# EAGLE design GSM_Based_Irrigation (EAGLE 6.3)
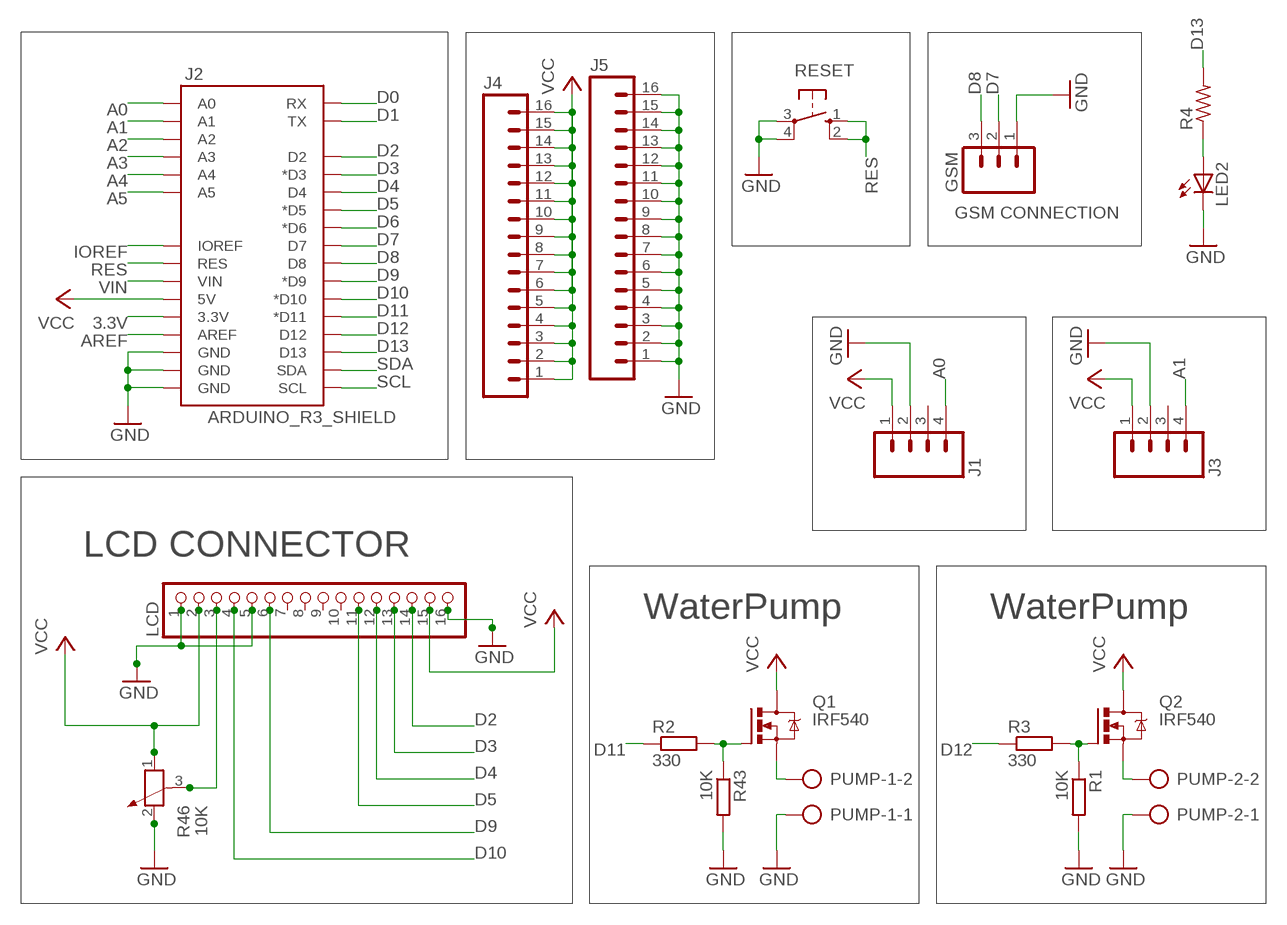
[diagram p0: schematic, sheet 1]

## Parts
GSM  M03LONGPADS  [1X03_LONGPADS]
J1  M04LONGPADS  [1X04_LONGPADS]
J2  ARDUINO_R3_SHIELD  [UNO_R3_SHIELD]
J3  M04LONGPADS  [1X04_LONGPADS]
J4  M16LONGPADS  [1X16_LONGPADS]
J5  M16LONGPADS  [1X16_LONGPADS]
LCD  PINHD-1X16  [1X16]
LED2  LED5MM  [LED5MM]
PUMP-1  AK300/2  [AK300/2]
PUMP-2  AK300/2  [AK300/2]
Q1  IRF540  [TO220BV]
Q2  IRF540  [TO220BV]
R1  10K  R-EU_0207/7  [0207/7@1]
R2  330  R-EU_0207/7  [0207/7@1]
R3  330  R-EU_0207/7  [0207/7@1]
R4  R-US_0207/10  [0207/10]
R43  10K  R-EU_0207/7  [0207/7@1]
R46  10K  POTENTIOMETER_PT-10  [PT-10]
RESET  10-XX  [B3F-10XX]

## Nets
3.3V: J2.3.3V
A0: J1.4 J2.A0
A1: J2.A1 J3.4
A2: J2.A2
A3: J2.A3
A4: J2.A4
A5: J2.A5
AREF: J2.AREF
D0: J2.RX
D1: J2.TX
D2: J2.D2 LCD.14
D3: J2.D3(*D3) LCD.13
D4: J2.D4 LCD.12
D5: J2.D5(*D5) LCD.11
D6: J2.D6(*D6)
D7: GSM.2 J2.D7
D8: GSM.3 J2.D8
D9: J2.D9(*D9) LCD.6
D10: J2.D10(*D10) LCD.4
D11: J2.D11(*D11) R2.1
D12: J2.D12 R3.1
D13: J2.D13 R4.2
GND: GSM.1 J1.2 J2.GND@0(GND) J2.GND@1(GND) J2.GND@2(GND) J3.2 J5.1 J5.2 J5.3 J5.4 J5.5 J5.6 J5.7 J5.8 J5.9 J5.10 J5.11 J5.12 J5.13 J5.14 J5.15 J5.16 LCD.1 LCD.5 LCD.16 LED2.K(C) PUMP-1.1 PUMP-2.1 R1.2 R43.2 R46.2 RESET.3(P) RESET.4(P1)
IOREF: J2.IOREF
N$1: PUMP-1.2 Q1.S
N$2: PUMP-2.2 Q2.S
N$3: Q1.G R2.2 R43.1
N$4: LED2.A R4.1
N$5: Q2.G R1.1 R3.2
N$68: LCD.3 R46.3
RES: J2.RES RESET.1(S) RESET.2(S1)
SCL: J2.SCL
SDA: J2.SDA
VCC: J1.1 J2.5V J3.1 J4.1 J4.2 J4.3 J4.4 J4.5 J4.6 J4.7 J4.8 J4.9 J4.10 J4.11 J4.12 J4.13 J4.14 J4.15 J4.16 LCD.2 LCD.15 Q1.D Q2.D R46.1
VIN: J2.VIN
Unconnected: J1.3 J3.3 LCD.7 LCD.8 LCD.9 LCD.10

## Notes on the sheet
- GSM CONNECTION
- LCD CONNECTOR
- WaterPump | WaterPump

## Library data of the parts
GSM = SparkFun-Connectors:M03: Header 3 Standard 3-pin 0.1" header. Use with straight break away headers (SKU : PRT-00116), right angle break away headers (PRT-00553), swiss pins (PRT-00743), machine pins (PRT-00117), and female headers (PRT-00115). Molex polarized connector foot print use with SKU : PRT-08232 with associated crimp pins and housings.
J1 J3 = SparkFun-Connectors:M04: Header 4 Standard 4-pin 0.1" header. Use with straight break away headers (SKU : PRT-00116), right angle break away headers (PRT-00553), swiss pins (PRT-00743), machine pins (PRT-00117), and female headers (PRT-00115). Molex polarized connector foot print use with SKU : PRT-08231 with associated crimp pins and housings. 1MM SMD Version SKU: PRT-10208; PROD_ID: CONN-09696
J2 = SparkFun-Boards:ARDUINO_R3_SHIELD: Shield form compatible with the Arduino Uno R3.
J4 J5 = SparkFun-Connectors:M16: 1x16 .1" header
LCD = pinhead:PINHD-1X16: PIN HEADER
LED2 = led:LED: LED OSRAM: - CHIPLED LG R971, LG N971, LY N971, LG Q971, LY Q971, LO R971, LY R971 LH N974, LH R974 LS Q976, LO Q976, LY Q976 LO Q996 - Hyper CHIPLED LW Q18S LB Q993, LB Q99A, LB R99A - SideLED LS A670, LO A670, LY A670, LG A670, LP A670 LB A673, LV A673, LT A673, LW A673 LH A674 LY A675 LS A676, LA A676, LO A676, LY A676, LW A676 LS A679, LY A679, LG A679 - Hyper Micro SIDELED® LS Y876, LA Y876, LO Y876, LY Y876 LT Y87S - SmartLED LW L88C, LW L88S LB L89C, LB L89S, LG L890 LS L89K, LO L89K, LY L89K LS L896, LA L896, LO L896, LY L896 - TOPLED LS T670, LO T670, LY T670, LG T670, LP T670 LSG T670, LSP T670, LSY T670, LOP T670, LYG T670 LG T671, LOG T671, LSG T671 LB T673, LV T673, LT T673, LW T673 LH T674 LS T676, LA T676, LO T676, LY T676, LB T676, LH T676, LSB T676, LW T676 LB T67C, LV T67C, LT T67C, LS T67K, LO T67K, LY T67K, LW E67C LS E67B, LA E67B, LO E67B, LY E67B, LB E67C, LV E67C, LT E67C LW T67C LS T679, LY T679, LG T679 LS T770, LO T770, LY T770, LG T770, LP T770 LB T773, LV T773, LT T773, LW T773 LH T774 LS E675, LA E675, LY E675, LS T675 LS T776, LA T776, LO T776, LY T776, LB T776 LHGB T686 LT T68C, LB T68C - Hyper Mini TOPLED® LB M676 - Mini TOPLED Santana® LG M470 LS M47K, LO M47K, LY M47K Source: http://www.osram.convergy.de LUXEON: - LUMILED® LXK2-PW12-R00, LXK2-PW12-S00, LXK2-PW14-U00, LXK2-PW14-V00 LXK2-PM12-R00, LXK2-PM12-S00, LXK2-PM14-U00 LXK2-PE12-Q00, LXK2-PE12-R00, LXK2-PE12-S00, LXK2-PE14-T00, LXK2-PE14-U00 LXK2-PB12-K00, LXK2-PB12-L00, LXK2-PB12-M00, LXK2-PB14-N00, LXK2-PB14-P00, LXK2-PB14-Q00 LXK2-PR12-L00, LXK2-PR12-M00, LXK2-PR14-Q00, LXK2-PR14-R00 LXK2-PD12-Q00, LXK2-PD12-R00, LXK2-PD12-S00 LXK2-PH12-R00, LXK2-PH12-S00 LXK2-PL12-P00, LXK2-PL12-Q00, LXK2-PL12-R00 Source: www.luxeon.com KINGBRIGHT: KA-3528ASYC Source: www.kingbright.com
PUMP-1 PUMP-2 = con-ptr500:AK300/2: CONNECTOR; OC_FARNELL: unknown; OC_NEWARK: unknown
Q1 Q2 = transistor-power:IRF540: HEXFET Power MOSFET
R1-R3 R43 = rcl:R-EU_: RESISTOR, European symbol
R4 = rcl:R-US_: RESISTOR, American symbol
R46 = rcl:POTENTIOMETER_: Potentiometer
RESET = switch-omron:10-XX: OMRON SWITCH; MPN: B3F-1000; OC_FARNELL: 176432; OC_NEWARK: 36M3542

## Board
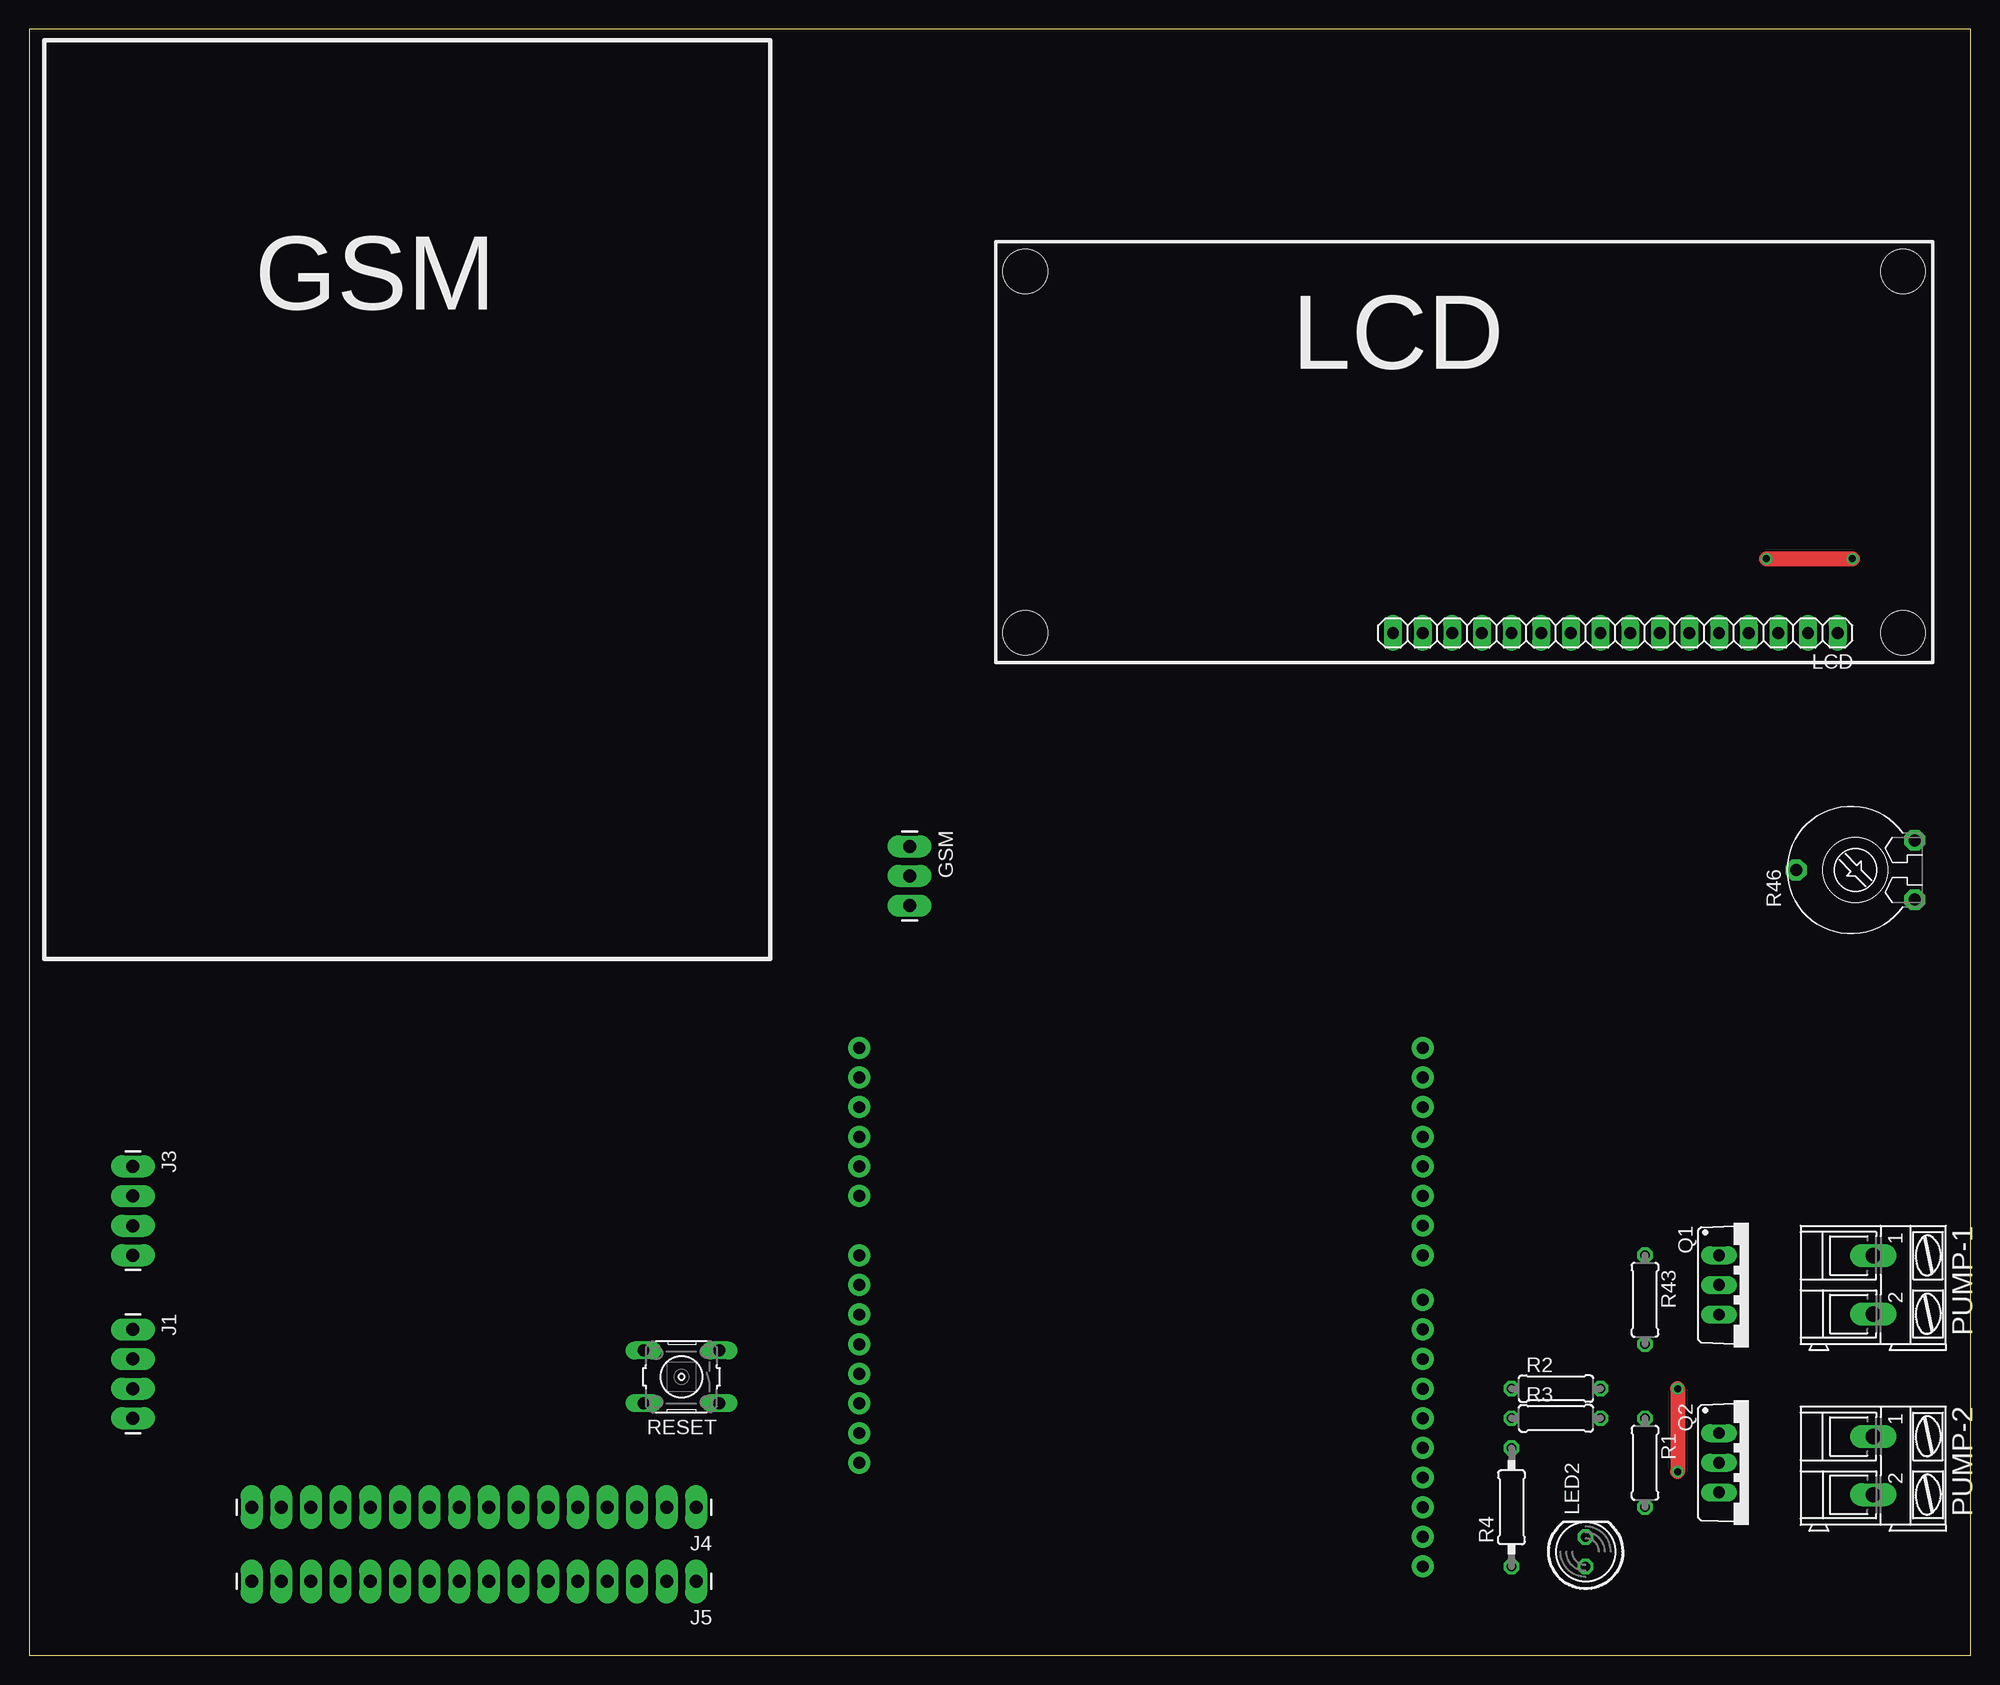
[diagram p1: board, top side]
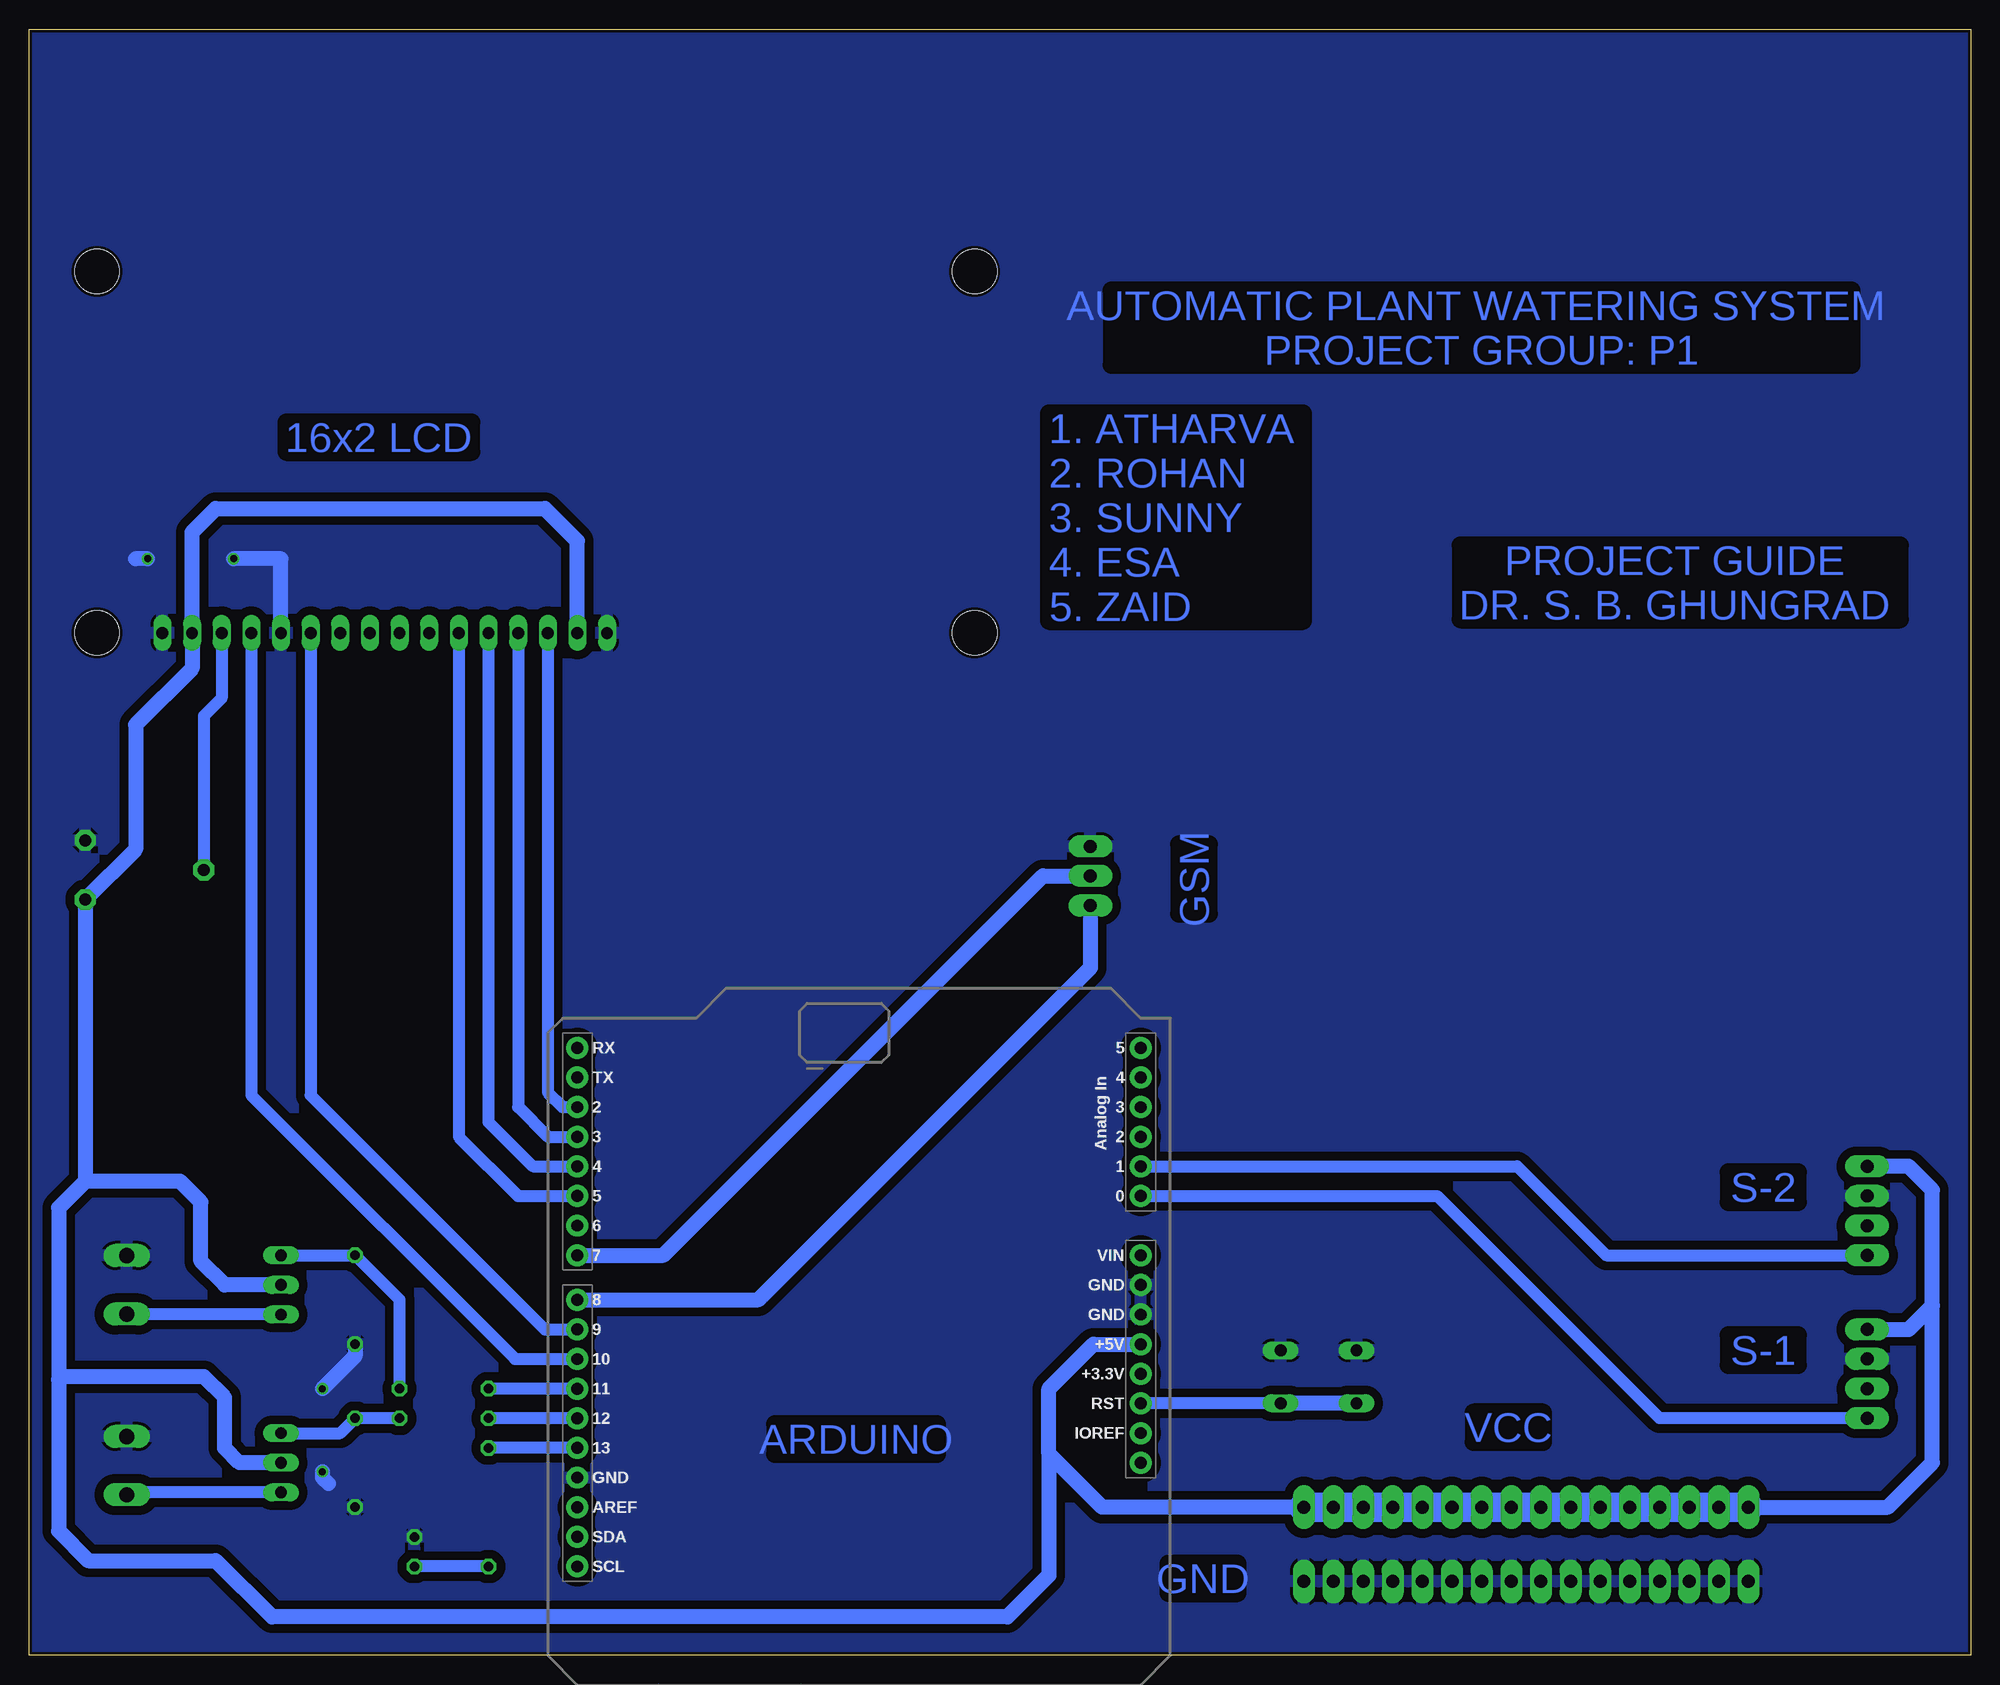
[diagram p2: board, bottom side, seen from below]

Size 166.35 x 139.37 mm. Coordinates in mm from the lower left corner, seen from the top.
Outline: 0,0 166.35,0 166.35,139.37 0,139.37 0,0
Copper layers (1*16): Top 0.035mm / dielectric 1.5mm / Bottom 0.035mm
Design rules "default *": minimum track width 10mil, minimum drill 24mil, track to track 30mil, track to pad 30mil, pad to pad 30mil, via to via 30mil, smd to smd 30mil, copper to edge 10mil, drill to drill 8mil, minimum pad ring 10mil, minimum via ring 8mil, stop-mask expansion 4mil, vias tented up to drill 0mil, thermal gap 10mil
Holes 3.81 mm at 85.34,118.62 85.34,87.63 160.53,87.63 160.53,118.62

### Footprints (pad centres in the part's own frame; a part is rotated, then mirrored left to right if it is on the bottom)
1X03_LONGPADS = drill 1.118 pad 1.88 long: 1 0,0; 2 2.54,0; 3 5.08,0
1X04_LONGPADS = drill 1.118 pad 1.88 long: 1 0,0; 2 2.54,0; 3 5.08,0; 4 7.62,0
UNO_R3_SHIELD = drill 1.016 pad 1.88: 3.3V 50.8,26.67; 5V 50.8,29.21; A0 50.8,41.91; A1 50.8,44.45; A2 50.8,46.99; A3 50.8,49.53; A4 50.8,52.07; A5 50.8,54.61; AREF 2.54,15.24; D2 2.54,49.53; D3 2.54,46.99; D4 2.54,44.45; D5 2.54,41.91; D6 2.54,39.37; D7 2.54,36.83; D8 2.54,33.02; D9 2.54,30.48; D10 2.54,27.94; D11 2.54,25.4; D12 2.54,22.86; D13 2.54,20.32; GND@0 50.8,31.75; GND@1 50.8,34.29; GND@2 2.54,17.78; IOREF 50.8,21.59; NC 50.8,19.05; RES 50.8,24.13; RX 2.54,54.61; SCL 2.54,10.16; SDA 2.54,12.7; TX 2.54,52.07; VIN 50.8,36.83
1X16_LONGPADS = drill 1.118 pad 1.88 long: 1 0,0; 2 2.54,0; 3 5.08,0; 4 7.62,0; 5 10.16,0; 6 12.7,0; 7 15.24,0; 8 17.78,0; 9 20.32,0; 10 22.86,0; 11 25.4,0; 12 27.94,0; 13 30.48,0; 14 33.02,0; 15 35.56,0; 16 38.1,0
1X16 = drill 1.016 long: 1 -19.05,0; 2 -16.51,0; 3 -13.97,0; 4 -11.43,0; 5 -8.89,0; 6 -6.35,0; 7 -3.81,0; 8 -1.27,0; 9 1.27,0; 10 3.81,0; 11 6.35,0; 12 8.89,0; 13 11.43,0; 14 13.97,0; 15 16.51,0; 16 19.05,0
LED5MM = drill 0.813 octagon: A -1.27,0; K 1.27,0
AK300/2 = drill 1.321 long: 1 -2.515,0; 2 2.489,0
TO220BV = drill 1.016 long: D 0,-2.54; G -2.54,-2.54; S 2.54,-2.54
0207/7@1 = drill 0.813 octagon: 1 -3.81,0; 2 3.81,0
0207/10 = drill 0.813 octagon: 1 -5.08,0; 2 5.08,0
PT-10 = drill 1.016 pad 1.778 octagon: 1 -2.54,-5.08; 2 2.54,-5.08; 3 0,5.08
B3F-10XX = drill 1.016 long: 1 -3.251,2.261; 2 3.251,2.261; 3 -3.251,-2.261; 4 3.251,-2.261

### Placement (x,y rotation side)
GSM  75.44,69.34 270 top
J1  8.89,27.94 270 top
J2  121.92,-2.54 0 bottom
J3  8.89,41.91 270 top
J4  57.15,12.7 180 top
J5  57.15,6.35 180 top
LCD  135.89,87.63 180 top
LED2  133.35,8.89 90 top
PUMP-1  157.99,31.75 270 top
PUMP-2  157.99,16.26 270 top
Q1  147.32,31.75 270 top
Q2  147.32,16.51 270 top
R1  138.43,16.51 270 top
R2  130.81,22.86 0 top
R3  130.81,20.32 0 top
R4  127,12.7 90 top
R43  138.43,30.48 270 top
R46  156.46,67.31 90 top
RESET  55.88,23.88 180 top

### Tracks (layer width: path | path; a pad name or v marks a point on that pad's centre or on a via)
A0
  Bottom 1.016: J2.A0 45.72,39.37 26.67,20.32 J1.4
A1
  Bottom 1.016: J2.A1 38.86,41.91 31.24,34.29 J3.4
D2
  Bottom 1.016: LCD.14 121.92,48.26 120.65,46.99 J2.D2
D3
  Bottom 1.016: LCD.13 124.46,46.99 121.92,44.45 J2.D3
D4
  Bottom 1.016: LCD.12 127,45.72 123.19,41.91 J2.D4
D5
  Bottom 1.016: LCD.11 129.54,44.45 124.46,39.37 J2.D5
D7
  Bottom 1.27: J2.D7 112.01,34.29 79.5,66.8 GSM.2
D8
  Bottom 1.27: GSM.3 75.44,58.93 103.38,30.99 103.63,30.73 103.89,30.48 J2.D8
D9
  Bottom 1.016: LCD.6 142.24,48.01 122.17,27.94 J2.D9
D10
  Bottom 1.016: LCD.4 147.32,48.01 124.71,25.4 J2.D10
D11
  Bottom 1.016: J2.D11 R2.1
D12
  Bottom 1.016: J2.D12 R3.1
D13
  Bottom 1.016: J2.D13 R4.2
GND  (via drill 0.6)
  Top 1.27: v148.84,93.98 v156.21,93.98 | v141.22,22.86 v141.22,15.75
  Bottom 1.27: LCD.5 144.78,93.98 v148.84,93.98 | v156.21,93.98 157.23,93.98 | R43.2 138.43,25.65 v141.22,22.86 | v141.22,15.75 141.22,15.24 140.72,14.73
  pour Bottom: -1.27,140.97 167.64,140.97 167.64,-1.27 -1.27,-1.27
N$1
  Bottom 1.016: Q1.S 157.94,29.21 PUMP-1.2
N$2
  Bottom 1.016: Q2.S 157.94,13.97 PUMP-2.2
N$3
  Bottom 1.016: R2.2 134.62,30.48 R43.1 Q1.G
N$4
  Bottom 1.016: R4.1 LED2.A
N$5
  Bottom 1.016: R3.2 R1.1 139.7,19.05 Q2.G
N$68
  Bottom 1.016: LCD.3 149.86,82.04 151.38,80.52 R46.3
RES
  Bottom 1.016: RESET.1 71.09,21.61 J2.RES
  Bottom 1.27: RESET.2 RESET.1
VCC
  Bottom 1.27: Q1.D 149.61,31.75 151.64,33.78 151.64,38.86 153.42,40.64 161.54,40.64 | J1.1 5.33,27.94 3.3,29.97 | 3.3,29.97 3.3,39.88 5.33,41.91 J3.1 | J4.16 7.11,12.7 3.3,16.51 3.3,29.97 | J4.1 74.42,12.7 78.99,17.27 | 78.99,17.27 78.99,22.86 75.18,26.67 J2.5V | 78.99,17.27 78.99,6.86 82.55,3.3 145.54,3.3 150.37,8.13 161.29,8.13 163.83,10.67 163.83,23.62 | 161.54,40.64 R46.1 157.23,69.09 157.23,79.76 152.4,84.58 LCD.2 152.4,96.27 150.37,98.3 122.17,98.3 119.38,95.5 LCD.15 | 161.54,40.64 163.83,38.35 163.83,23.62 | Q2.D 148.34,16.51 149.61,17.78 149.61,22.1 151.38,23.88 163.58,23.88 163.83,23.62
  Bottom 2.54: J4.16 J4.15 J4.14 J4.13 J4.12 J4.11 J4.10 J4.9 J4.8 J4.7 J4.6 J4.5 J4.4 J4.3 J4.2 J4.1

### Text on the board
Bottom: AUTOMATIC PLANT WATERING SYSTEM / PROJECT GROUP: P1 | 16x2 LCD | PROJECT GUIDE / DR. S. B. GHUNGRAD | 1. ATHARVA / 2. ROHAN / 3. SUNNY / 4. ESA / 5. ZAID | GSM | S-2 | S-1 | VCC | ARDUINO | GND
tPlace: GSM | LCD